# EasyEDA Pro project macropad.epro

# Schematic Schematic2
Board Name: PCB3; Create Date: 2026-05-14; Page Name: P1; Project Name: FALLOUT HK PAD; Schematic Name: Schematic2; Update Date: 2026-05-15; Company: EasyEDA.com; Page Size: A4; Version: V1.0
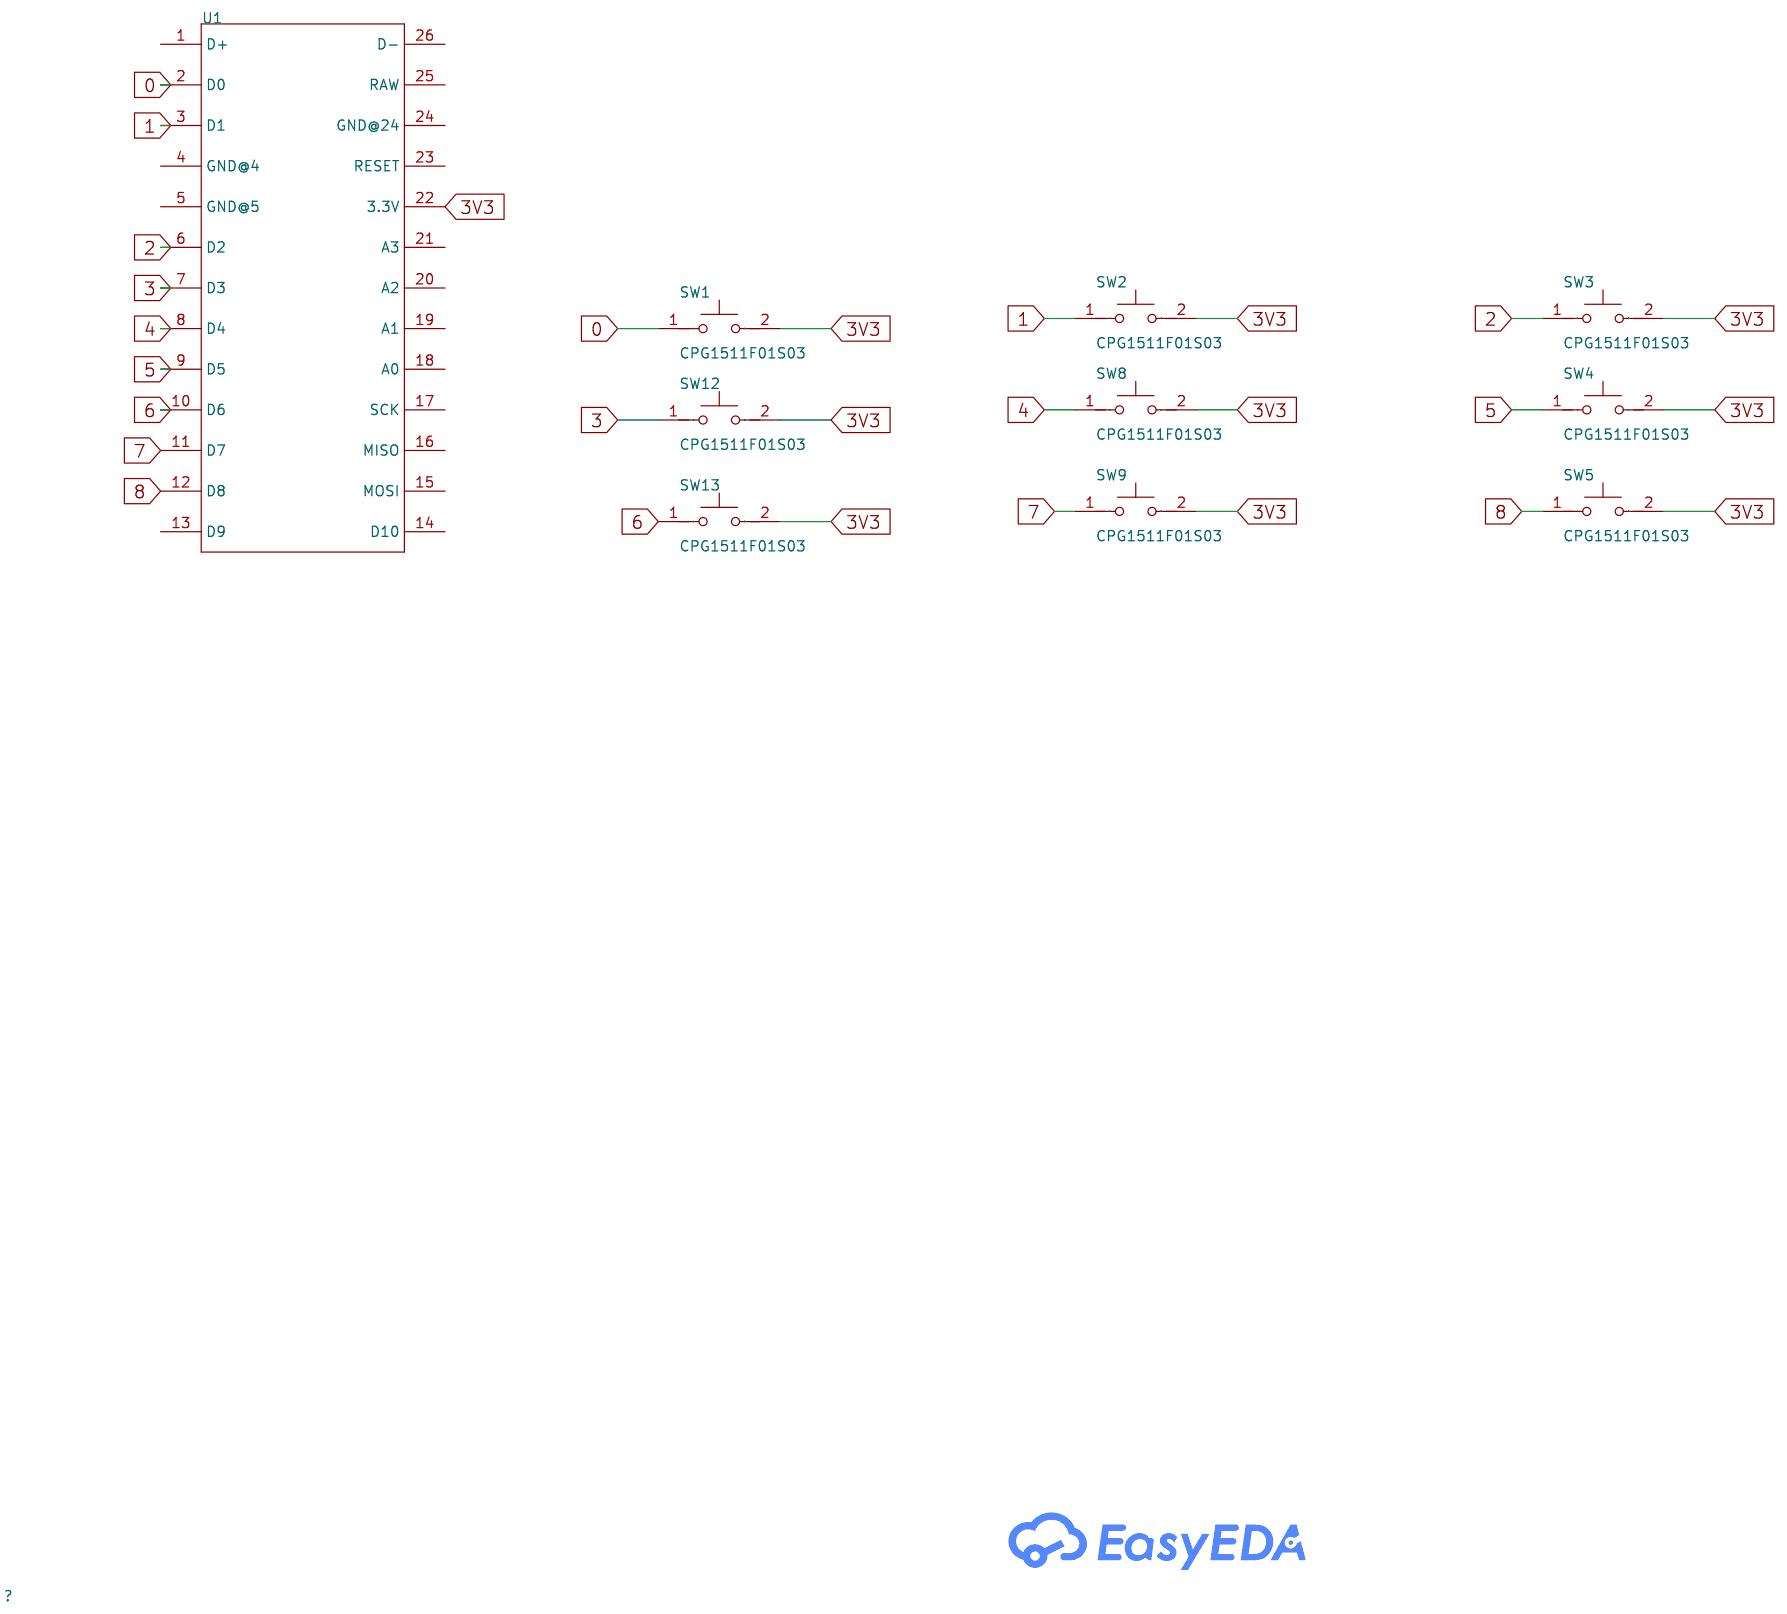
[diagram p0: schematic sheet]

## Parts
SW1  CPG1511F01S03  [KEY-TH_CPG1511F01S0X]
SW2  CPG1511F01S03  [KEY-TH_CPG1511F01S0X]
SW3  CPG1511F01S03  [KEY-TH_CPG1511F01S0X]
SW4  CPG1511F01S03  [KEY-TH_CPG1511F01S0X]
SW5  CPG1511F01S03  [KEY-TH_CPG1511F01S0X]
SW8  CPG1511F01S03  [KEY-TH_CPG1511F01S0X]
SW9  CPG1511F01S03  [KEY-TH_CPG1511F01S0X]
SW12  CPG1511F01S03  [KEY-TH_CPG1511F01S0X]
SW13  CPG1511F01S03  [KEY-TH_CPG1511F01S0X]
U1  -  [KB2040_SMD]

## Library data of the parts
SW1-SW5 SW8 SW9 SW12 SW13 = CPG1511F01S03: Axis Type:Tea shaft Operating Voltage:2V~12V Operating Voltage:2V~12V Pin:2 Mechanical Life:80 million times Operation Force:45gf@±10gf Conduction Travel:1.8mm Total Travel:3.6mm Operating Temperature:-10℃~+70℃ Operating Temperature:-10℃~+70℃; LCSC Part Name: BOX 茶轴; Supplier Part: C400227; Manufacturer: Kailh(凯华); Supplier Footprint: 插件; JLCPCB Part Class: Extended Part; Datasheet: https://atta.szlcsc.com/upload/public/pdf/source/20190626/C400227_9840BEAC9BD912FCFC7F12B0413210EA.pdf; Supplier: LCSC; Axis Type: Tea shaft; Operating Voltage: 2V~12V; Pin: 2; Mechanical Life: 80 million times; Operation Force: 45gf@±10gf; Conduction Travel: 1.8mm; Total Travel: 3.6mm; Operating Temperature: -10℃~+70℃
U1 = KB2040

## Nets
3V3: SW1.2 SW2.2 SW3.2 SW4.2 SW5.2 SW8.2 SW9.2 SW12.2 SW13.2 U1.22(3.3V)
0: SW1.1 U1.2(D0)
1: SW2.1 U1.3(D1)
2: SW3.1 U1.6(D2)
3: SW12.1 U1.7(D3)
4: SW8.1 U1.8(D4)
5: SW4.1 U1.9(D5)
6: SW13.1 U1.10(D6)
7: SW9.1 U1.11(D7)
8: SW5.1 U1.12(D8)

Not connected (* = marked no-connect by the designer): U1 1(D+) 4(GND@4) 5(GND@5) 13(D9) 14(D10) 15(MOSI) 16(MISO) 17(SCK) 18(A0) 19(A1) 20(A2) 21(A3) 23(RESET) 24(GND@24) 25(RAW) 26(D-)
